# Altium schematic sheet Sheet1.SchDoc
size B; Author: Феликс Лазарев; DrawnBy: Феликс Лазарев; Revision: 1; DocumentName: Контроллер  СF на ПЗУ
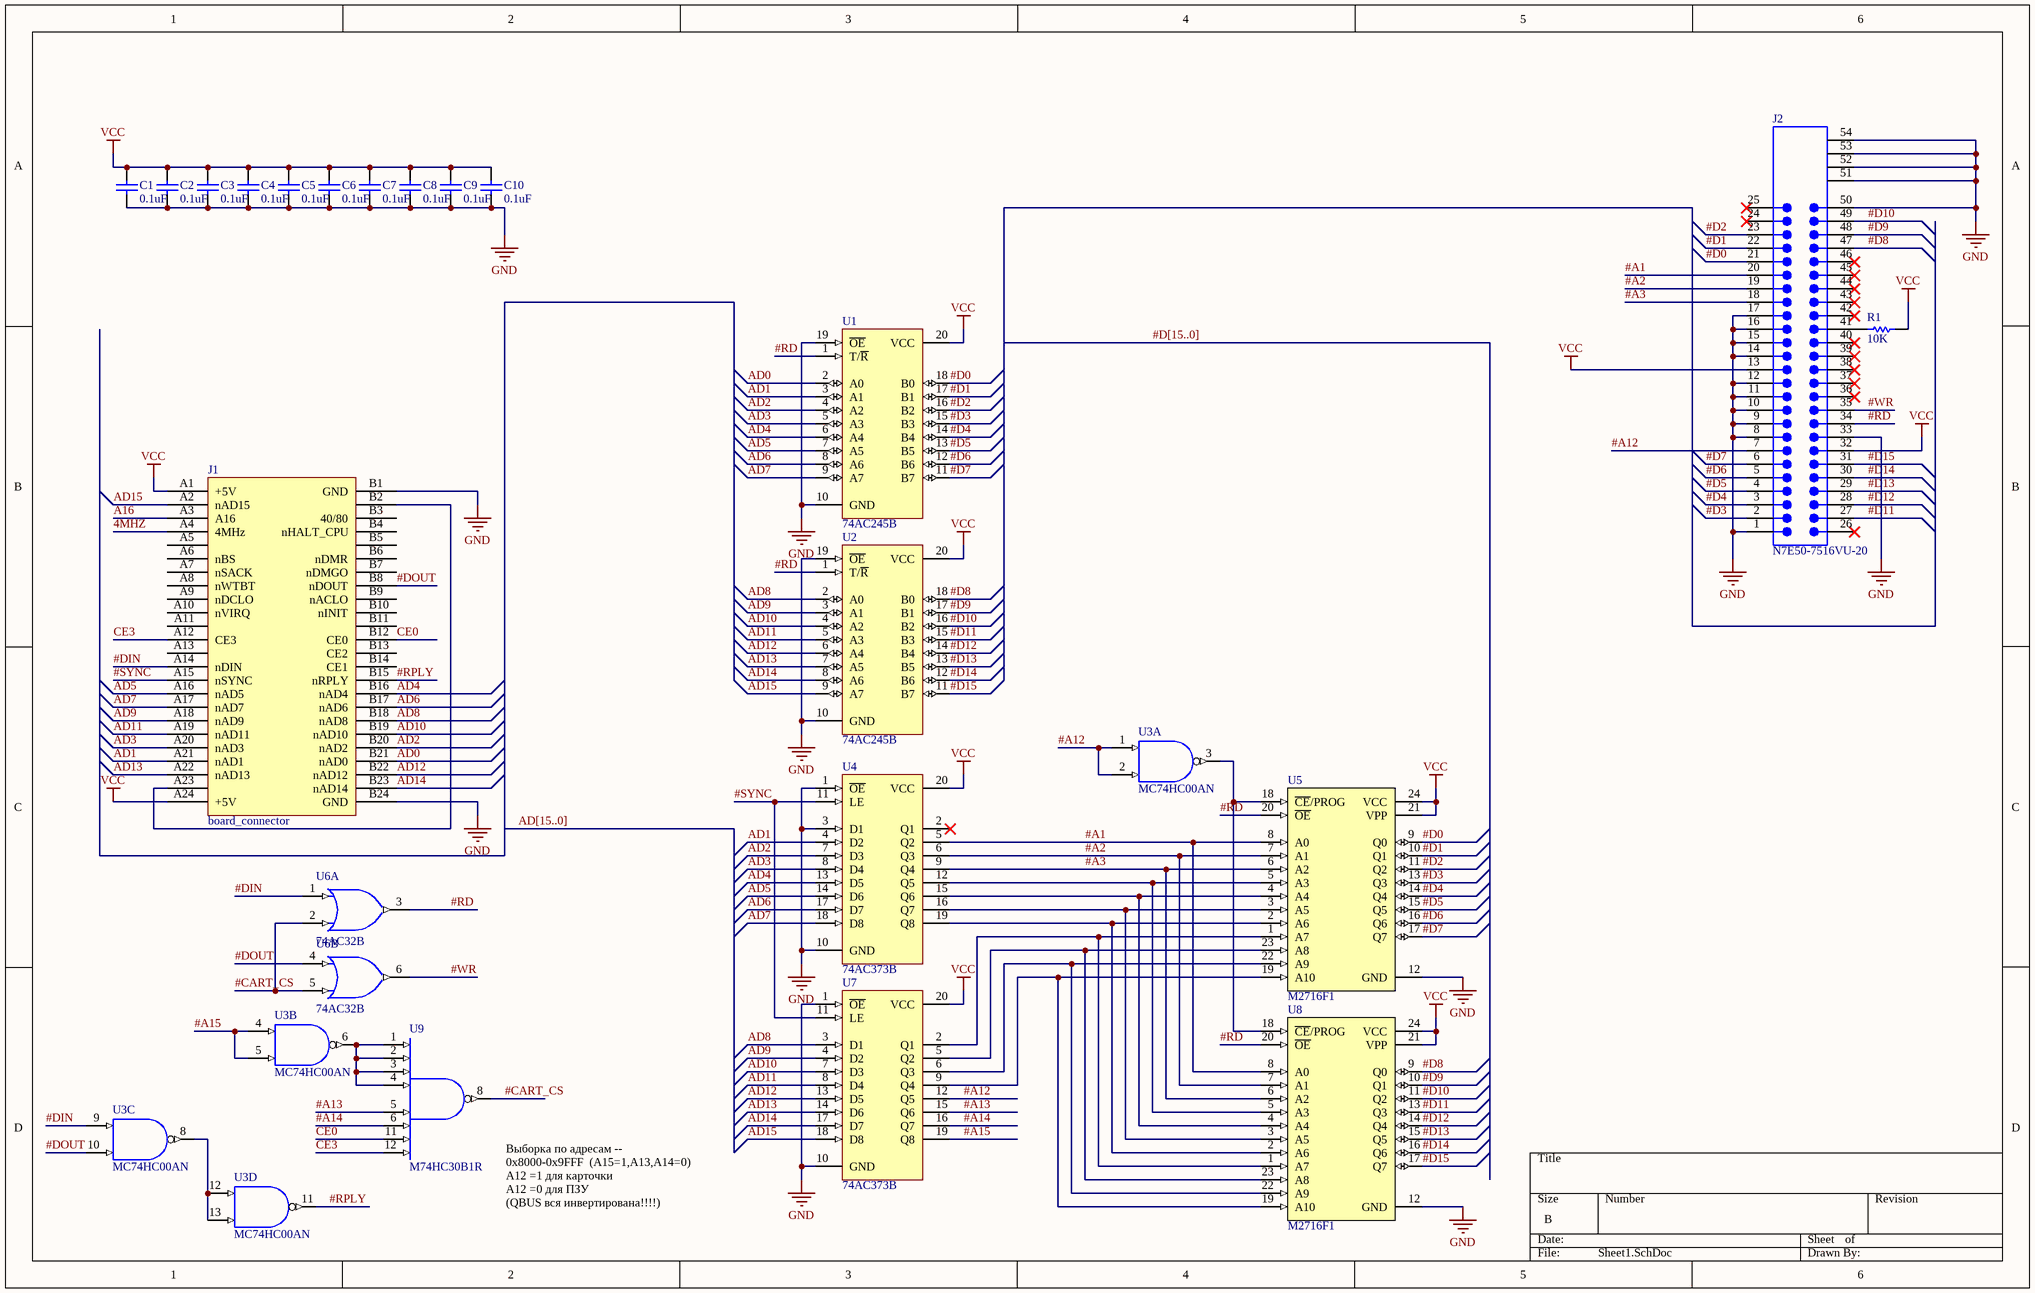
[diagram p0: Sheet1.SchDoc]

## Parts
C1  0.1uF  [0805]
C2  0.1uF  [0805]
C3  0.1uF  [0805]
C4  0.1uF  [0805]
C5  0.1uF  [0805]
C6  0.1uF  [0805]
C7  0.1uF  [0805]
C8  0.1uF  [0805]
C9  0.1uF  [0805]
C10  0.1uF  [0805]
J1  board_connector
J2  N7E50-7516VU-20  [N7E50-7516]
R1  10K  [6-0805]
U1  74AC245B  [DIP20]
U2  74AC245B  [DIP20]
U3  MC74HC00AN  [646-06]  (parts A,B,C,D of 4)
U4  74AC373B  [DIP20]
U5  M2716F1  [FDIP24W]
U6  74AC32B  [DIP14]  (parts A,B of 4)
U7  74AC373B  [DIP20]
U8  M2716F1  [FDIP24W]
U9  M74HC30B1R  [DIP14]

## Nets
GND: C1.1 C2.1 C3.1 C4.1 C5.1 C6.1 C7.1 C8.1 C9.1 C10.1 J1.B1(GND) J1.B24(GND) J2.1 J2.8 J2.9 J2.10 J2.11 J2.12 J2.14 J2.15 J2.16 J2.17 J2.33 J2.50 J2.51(MH1) J2.52(MH2) J2.53(MH3) J2.54(MH4) U1.10(GND) U1.19(~{OE}) U2.10(GND) U2.19(~{OE}) U3.7(GND) U4.1(~{OE}) U4.3(D1) U4.10(GND) U5.12(GND) U6.7(GND) U7.1(~{OE}) U7.10(GND) U8.12(GND) U9.7(GND)
VCC: C1.2 C2.2 C3.2 C4.2 C5.2 C6.2 C7.2 C8.2 C9.2 C10.2 J1.A1(+5V) J1.A24(+5V) J2.13 J2.32 R1.2 U1.20(VCC) U2.20(VCC) U3.14(VCC) U4.20(VCC) U5.21(VPP) U5.24(VCC) U6.14(VCC) U7.20(VCC) U8.21(VPP) U8.24(VCC) U9.14(VCC)
4MHZ: J1.A4(4MHz)
#A1: J2.20 U4.5(Q2) U5.8(A0) U8.8(A0)
#A2: J2.19 U4.6(Q3) U5.7(A1) U8.7(A1)
#A3: J2.18 U4.9(Q4) U5.6(A2) U8.6(A2)
#A12: J2.7 U3.1(A) U3.2(B) U7.12(Q5)
#A13: U7.15(Q6) U9.5(E)
#A14: U7.16(Q7) U9.6(F)
#A15: U3.4(A) U3.5(B) U7.19(Q8)
#CART_CS: U6.2(B) U6.5(B) U9.8(Y)
#D0: J2.21 U1.18(B0) U5.9(Q0)
#D1: J2.22 U1.17(B1) U5.10(Q1)
#D2: J2.23 U1.16(B2) U5.11(Q2)
#D3: J2.2 U1.15(B3) U5.13(Q3)
#D4: J2.3 U1.14(B4) U5.14(Q4)
#D5: J2.4 U1.13(B5) U5.15(Q5)
#D6: J2.5 U1.12(B6) U5.16(Q6)
#D7: J2.6 U1.11(B7) U5.17(Q7)
#D8: J2.47 U2.18(B0) U8.9(Q0)
#D9: J2.48 U2.17(B1) U8.10(Q1)
#D10: J2.49 U2.16(B2) U8.11(Q2)
#D11: J2.27 U2.15(B3) U8.13(Q3)
#D12: J2.28 U2.14(B4) U8.14(Q4)
#D13: J2.29 U2.13(B5) U8.15(Q5)
#D14: J2.30 U2.12(B6) U8.16(Q6)
#D15: J2.31 U2.11(B7) U8.17(Q7)
#DIN: J1.A14(nDIN) U3.9(A) U6.1(A)
#DOUT: J1.B8(nDOUT) U3.10(B) U6.4(A)
#RD: J2.34 U1.1(T/~{R}) U2.1(T/~{R}) U5.20(~{OE}) U6.3(Y) U8.20(~{OE})
#RPLY: J1.B15(nRPLY) U3.11(~{Y})
#SYNC: J1.A15(nSYNC) U4.11(LE) U7.11(LE)
#WR: J2.35 U6.6(Y)
A16: J1.A3(A16)
AD0: J1.B21(nAD0) U1.2(A0)
AD1: J1.A21(nAD1) U1.3(A1) U4.4(D2)
AD2: J1.B20(nAD2) U1.4(A2) U4.7(D3)
AD3: J1.A20(nAD3) U1.5(A3) U4.8(D4)
AD4: J1.B16(nAD4) U1.6(A4) U4.13(D5)
AD5: J1.A16(nAD5) U1.7(A5) U4.14(D6)
AD6: J1.B17(nAD6) U1.8(A6) U4.17(D7)
AD7: J1.A17(nAD7) U1.9(A7) U4.18(D8)
AD8: J1.B18(nAD8) U2.2(A0) U7.3(D1)
AD9: J1.A18(nAD9) U2.3(A1) U7.4(D2)
AD10: J1.B19(nAD10) U2.4(A2) U7.7(D3)
AD11: J1.A19(nAD11) U2.5(A3) U7.8(D4)
AD12: J1.B22(nAD12) U2.6(A4) U7.13(D5)
AD13: J1.A22(nAD13) U2.7(A5) U7.14(D6)
AD14: J1.B23(nAD14) U2.8(A6) U7.17(D7)
AD15: J1.A2(nAD15) U2.9(A7) U7.18(D8)
CE0: J1.B12(CE0) U9.11(G)
CE3: J1.A12(CE3) U9.12(H)
NetJ1_A23: J1.A23 J1.B2
NetJ2_41: J2.41 R1.1
NetU3_3: U3.3(~{Y}) U5.18(~{CE}/PROG) U8.18(~{CE}/PROG)
NetU3_6: U3.6(~{Y}) U9.1(A) U9.2(B) U9.3(C) U9.4(D)
NetU3_8: U3.8(~{Y}) U3.12(A) U3.13(B)
NetU4_12: U4.12(Q5) U5.5(A3) U8.5(A3)
NetU4_15: U4.15(Q6) U5.4(A4) U8.4(A4)
NetU4_16: U4.16(Q7) U5.3(A5) U8.3(A5)
NetU4_19: U4.19(Q8) U5.2(A6) U8.2(A6)
NetU5_1: U5.1(A7) U7.2(Q1) U8.1(A7)
NetU5_19: U5.19(A10) U7.9(Q4) U8.19(A10)
NetU5_22: U5.22(A9) U7.6(Q3) U8.22(A9)
NetU5_23: U5.23(A8) U7.5(Q2) U8.23(A8)

Not connected (* = marked no-connect by the designer): J1 A5 A6(nBS) A7(nSACK) A8(nWTBT) A9(nDCLO) A10(nVIRQ) A11 A13 B3(40/80) B4(nHALT_CPU) B5 B6(nDMR) B7(nDMGO) B9(nACLO) B10(nINIT) B11 B13(CE2) B14(CE1); J2 24* 25* 26* 36* 37* 38* 39* 40* 42* 43* 44* 45* 46*; U4 2(Q1)*

## Buses and harness runs
bus #D[15..0]
bus AD[15..0]

## Notes on the sheet
- (near U9) Выборка по адресам --
  0x8000-0x9FFF  (A15=1,A13,A14=0)
  A12 =1 для карточки
  A12 =0 для ПЗУ
  (QBUS вся инвертирована!!!!)

## Library data of the parts
C1-C10 = C0805: Ceramic Chip Capacitor - Standard; Note: Footprint corresponds to dimensions for bulk cassette packaging. This case size has tightened tolerances.; Published: 17-Jul-2002; LatestRevisionDate: 19-Mar-2004; LatestRevisionNote: Silkscreen size reduced.; DatasheetDocument: Mar-2001; PackageDocument: Mar-2001; PackageReference: 0805; Publisher: Altium Limited; Code_JEITA: 0805; Code_IPC: 2012[0805]; ComponentLink1Description: Manufacturer Link; ComponentLink1URL: http://www.kemet.com/; ComponentLink2Description: Datasheet; ComponentLink2URL: http://www.kemet.com/kemet/web/homepage/kechome.nsf/vapubfilesname/F3102TA.pdf/$file/F3102TA.pdf; Value: 0.1uF
J2 = N7E50-7516VU-20: CompactFlash Card Header, Type I; Surface Mount; 50W, 0.5A Current Rating; 0.050" x 0.050", 50-Position; Normal Card Polarization; PCB_Layout: Complies with manufacturer's recommendation.; Published: 6-Jun-2005; DatasheetDocument: May-2003; PackageDocument: May-2003; PackageReference: N7E50-7516; Publisher: Altium Limited; PadDimensions: Follow nominal values.; ComponentLink1Description: Manufacturer Link; ComponentLink1URL: http://www.3m.com/; ComponentLink2Description: 3M Interconnect; ComponentLink2URL: http://www.3M.com/us/electronics_mfg/interconnects/
R1 = ERJ6GE: Thick Film Chip Resistor, 1 Ohm to 10M Ohm Range, 5% Tolerance, 0805 Size, 0.125 W; Note: If flow soldering, adjust pad width of PCB Footprint to 0.7 - 0.8 times the width of the resistor.; Published: 17-Dec-2003; LatestRevisionDate: 19-Mar-2004; LatestRevisionNote: Silkscreen size reduced.; PackageDocument: Mar-2003; PackageReference: 6-0805; Publisher: Altium Limited; Code_IPC: 2012 [0805]; ComponentLink1Description: Manufacturer Link; ComponentLink1URL: http://www.panasonic.com/industrial/components/resistive_products.htm; ComponentLink2Description: Datasheet; ComponentLink2URL: http://www.panasonic.com/industrial/components/pdf/AOA0000CE1.pdf; Value: 10K
U1 U2 = 74AC245B: Octal Bus Transceiver 3-State Non-Inverting; Published: 8-Jun-2000; LatestRevisionDate: 06-Jun-2005; LatestRevisionNote: Stylized 3D Model Added.; DatasheetVersion: Apr-1997; PackageVersion: Jun-1998; PackageReference: DIP20; Publisher: Altium Limited; PackageDescription: DIP; 20 Leads; Row Spacing 7.62 mm; Pitch 2.54 mm; Code_JEDEC: MS-015-AE; ComponentLink1Description: Manufacturer Link; ComponentLink1URL: http://www.st.com/; ComponentLink2Description: Datasheet; ComponentLink2URL: http://www.st.com/stonline/products/literature/ds/4699/74ac245.pdf
U3 = MC74HC00AN: Quad 2-Input NAND Gate; Published: 15-Apr-2002; DatasheetVersion: Mar-2000; PackageVersion: 1995; PackageReference: 646-06; Publisher: Altium Limited; PackageDescription: DIP; 14 Leads; Row Spacing 7.62 mm; Pitch 2.54 mm; ComponentLink1Description: Manufacturer Link; ComponentLink1URL: http://www.onsemi.com/; ComponentLink2Description: Datasheet; ComponentLink2URL: http://www.onsemi.com/pub/Collateral/MC74HC00A-D.PDF
U4 U7 = 74AC373B: Octal D-Type Latch with 3-State Output Non-Inverting; Published: 8-Jun-2000; LatestRevisionDate: 06-Jun-2005; LatestRevisionNote: Stylized 3D Model Added.; DatasheetVersion: Apr-1997; PackageVersion: Jun-1998; PackageReference: DIP20; Publisher: Altium Limited; PackageDescription: DIP; 20 Leads; Row Spacing 7.62 mm; Pitch 2.54 mm; Code_JEDEC: MS-015-AE; ComponentLink1Description: Manufacturer Link; ComponentLink1URL: http://www.st.com/; ComponentLink2Description: Datasheet; ComponentLink2URL: http://www.st.com/stonline/products/literature/ds/4937/74ac373.pdf
U5 U8 = M2716F1: NMOS 16K (2K x 8) UV EPROM; Published: 24-Aug-2001; LatestRevisionDate: 06-Jun-2005; LatestRevisionNote: Stylized 3D Model Added.; DatasheetVersion: Jul-1994; PackageReference: FDIP24W; Publisher: Altium Limited; PackageDescription: Ceramic Frit-seal DIP, Window; 24 Leads; Row Spacing 15.24 mm; Pitch 2.54 mm; ComponentLink1Description: Manufacturer Link; ComponentLink1URL: http://www.st.com/
U6 = 74AC32B: Quad 2-Input OR Gate; Published: 8-Jun-2000; LatestRevisionDate: 06-Jun-2005; LatestRevisionNote: Stylized 3D Model Added.; DatasheetVersion: Apr-1997; PackageVersion: Jan-1997; PackageReference: DIP14; Publisher: Altium Limited; PackageDescription: DIP; 14 Leads; Row Spacing 7.62 mm; Pitch 2.54 mm; ComponentLink1Description: Manufacturer Link; ComponentLink1URL: http://www.st.com/; ComponentLink2Description: Datasheet; ComponentLink2URL: http://www.st.com/stonline/products/literature/ds/4695/74ac32.pdf
U9 = M74HC30B1R: 8-Input NAND Gate; Note: Pins 9, 10 and 13 are not connected and not drawn.; Published: 8-Jun-2000; LatestRevisionDate: 06-Jun-2005; LatestRevisionNote: Stylized 3D Model Added.; DatasheetVersion: Feb-1993; PackageVersion: Jan-1997; PackageReference: DIP14; Publisher: Altium Limited; PackageDescription: DIP; 14 Leads; Row Spacing 7.62 mm; Pitch 2.54 mm; ComponentLink1Description: Manufacturer Link; ComponentLink1URL: http://www.st.com/; ComponentLink2Description: Datasheet; ComponentLink2URL: http://www.st.com/stonline/products/literature/ds/1943/m74hc30.pdf